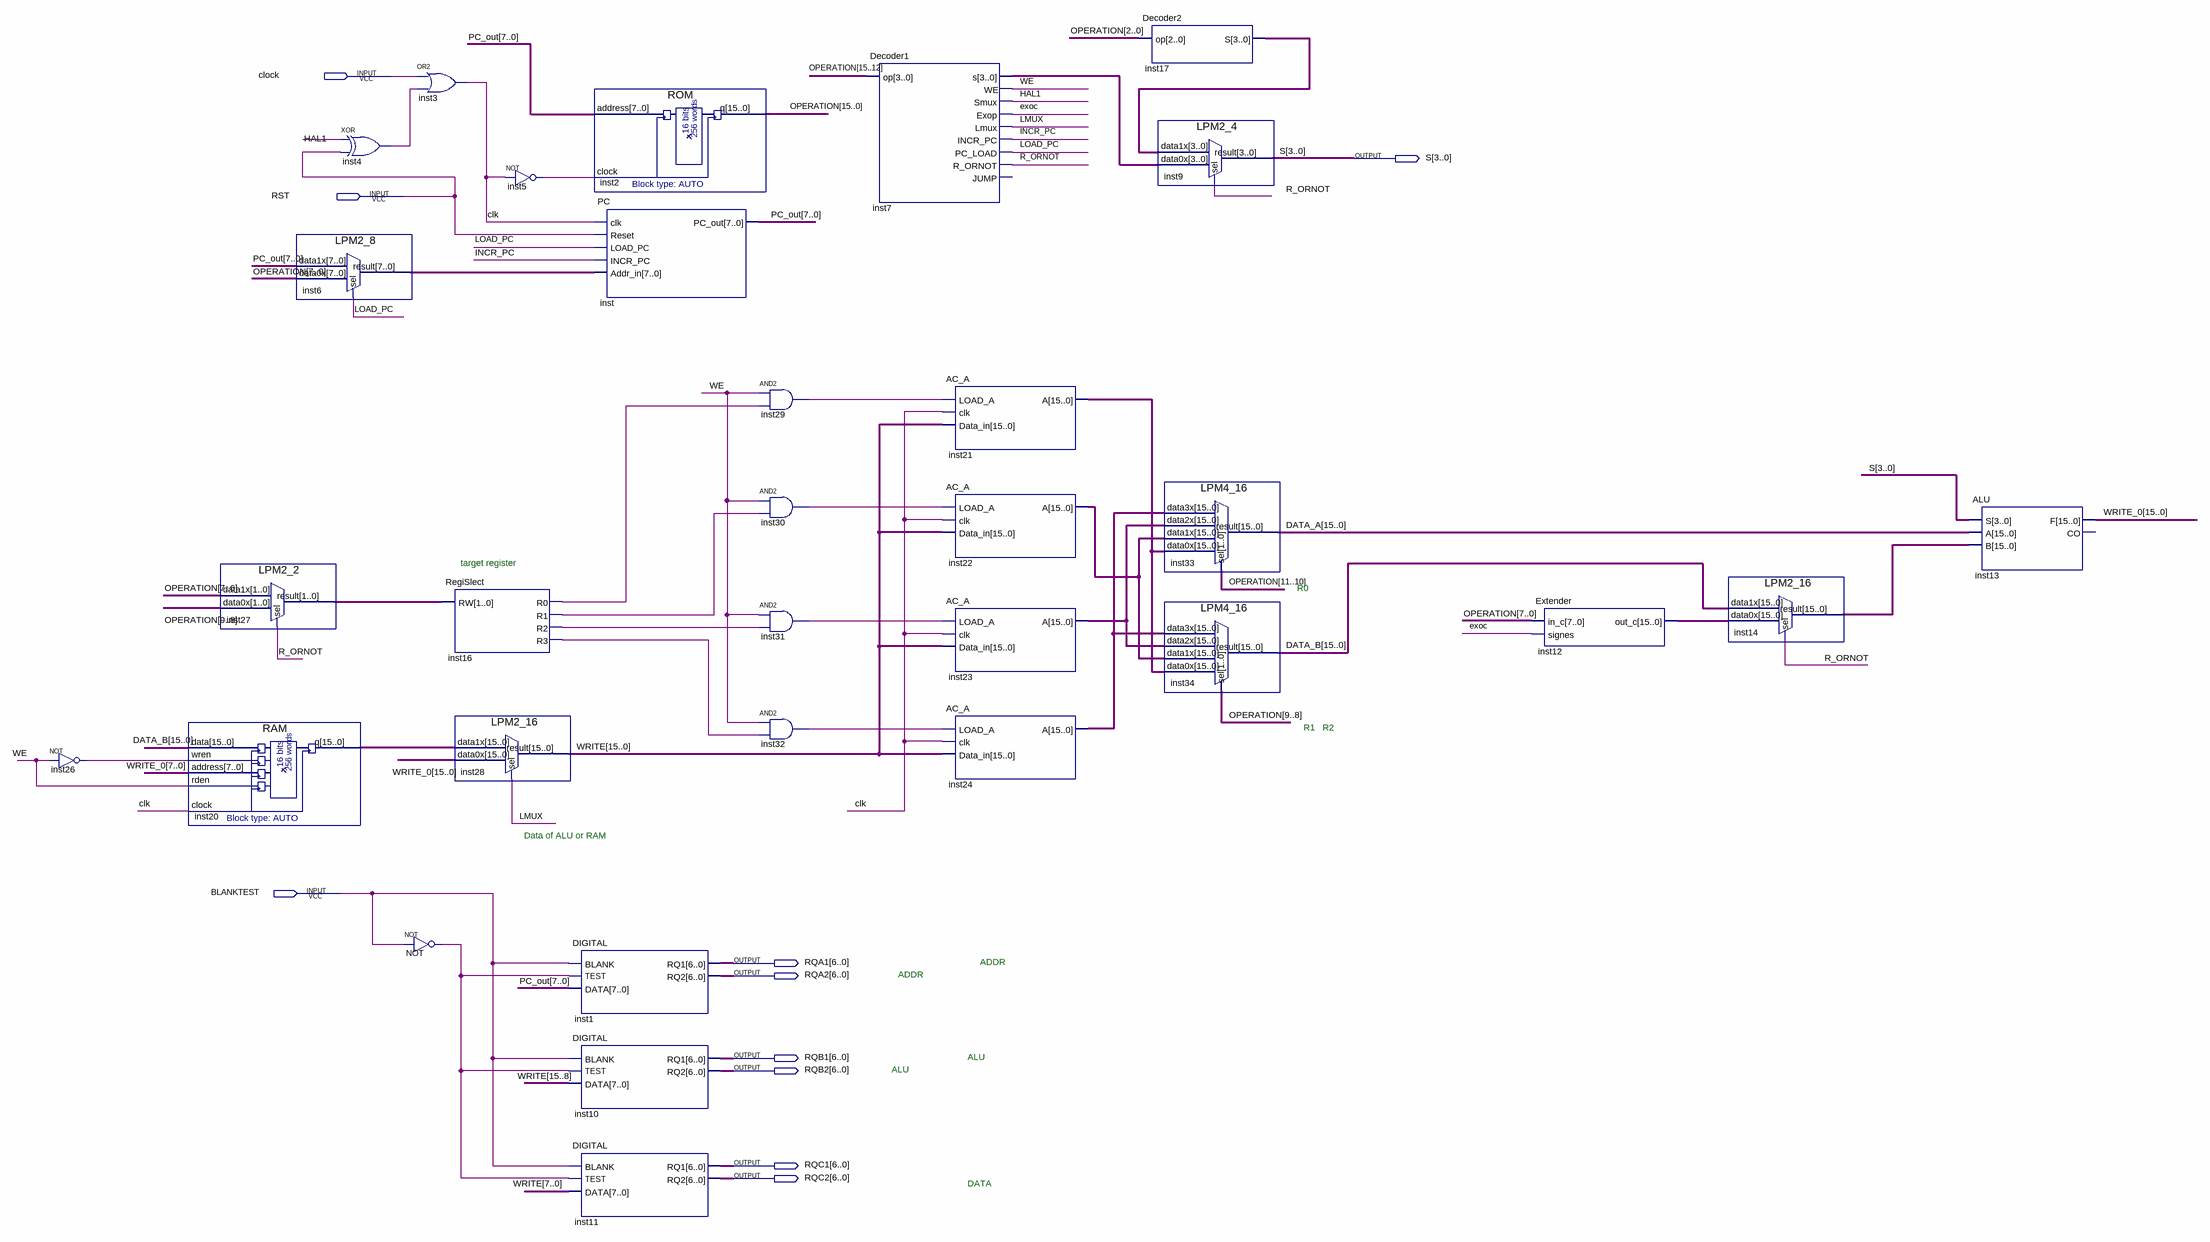
[diagram p0: schematic sheet]
// Quartus schematic CPU.bdf as structural Verilog: 31 symbols, 10 pins
module CPU (
  input  clock,
  input  RST,
  input  BLANKTEST,
  output [3:0] S,
  output [6:0] RQA1,
  output [6:0] RQA2,
  output [6:0] RQB1,
  output [6:0] RQB2,
  output [6:0] RQC1,
  output [6:0] RQC2
);

  wire clk, exoc, HAL1, INCR_PC, inst4_out, inst5_out, inst16_r0, inst16_r1, inst16_r2, inst16_r3,
       inst26_out, inst29_out, inst30_out, inst31_out, inst32_out, LMUX, LOAD_PC, NOT_out, R_ORNOT, WE;
  wire [1:0] inst27_result;
  wire [3:0] inst7_s, inst17_s;
  wire [7:0] inst6_result, PC_out;
  wire [15:0] DATA_A, DATA_B, inst12_out_c, inst14_result, inst20_q, inst21_a, inst22_a, inst23_a, inst24_a,
       OPERATION, WRITE, WRITE_0;

  not inst26 (inst26_out, WE);
  RAM inst20 (.data(DATA_B), .wren(inst26_out), .address(WRITE_0[7:0]), .rden(WE), .clock(clk), .q(inst20_q));
  LPM2_2 inst27 (.data1x(OPERATION[7:6]), .data0x(OPERATION[9:8]), .sel(R_ORNOT), .result(inst27_result));
  xor inst4 (inst4_out, HAL1, RST);
  LPM2_8 inst6 (.data1x(PC_out), .data0x(OPERATION[7:0]), .sel(LOAD_PC), .result(inst6_result));
  or inst3 (clk, clock, inst4_out);
  RegiSlect inst16 (.RW(inst27_result), .R0(inst16_r0), .R1(inst16_r1), .R2(inst16_r2), .R3(inst16_r3));
  not NOT (NOT_out, BLANKTEST);
  LPM2_16 inst28 (.data1x(inst20_q), .data0x(WRITE_0), .sel(LMUX), .result(WRITE));
  not inst5 (inst5_out, clk);
  ROM inst2 (.address(PC_out), .clock(inst5_out), .q(OPERATION));
  PC inst (.clk(clk), .Reset(RST), .LOAD_PC(LOAD_PC), .INCR_PC(INCR_PC), .Addr_in(inst6_result), .PC_out(PC_out));
  DIGITAL inst1 (.BLANK(BLANKTEST), .TEST(NOT_out), .DATA(PC_out), .RQ1(RQA1), .RQ2(RQA2));
  DIGITAL inst10 (.BLANK(BLANKTEST), .TEST(NOT_out), .DATA(WRITE[15:8]), .RQ1(RQB1), .RQ2(RQB2));
  DIGITAL inst11 (.BLANK(BLANKTEST), .TEST(NOT_out), .DATA(WRITE[7:0]), .RQ1(RQC1), .RQ2(RQC2));
  and inst29 (inst29_out, WE, inst16_r0);
  and inst30 (inst30_out, WE, inst16_r1);
  and inst31 (inst31_out, WE, inst16_r2);
  and inst32 (inst32_out, WE, inst16_r3);
  Decoder1 inst7 (
    .op(OPERATION[15:12]), .s(inst7_s), .WE(WE), .Smux(HAL1), .Exop(exoc), .Lmux(LMUX), .INCR_PC(INCR_PC),
    .PC_LOAD(LOAD_PC), .R_ORNOT(R_ORNOT));  // open: JUMP
  AC_A inst21 (.LOAD_A(inst29_out), .clk(clk), .Data_in(WRITE), .A(inst21_a));
  AC_A inst22 (.LOAD_A(inst30_out), .clk(clk), .Data_in(WRITE), .A(inst22_a));
  AC_A inst23 (.LOAD_A(inst31_out), .clk(clk), .Data_in(WRITE), .A(inst23_a));
  AC_A inst24 (.LOAD_A(inst32_out), .clk(clk), .Data_in(WRITE), .A(inst24_a));
  Decoder2 inst17 (.op(OPERATION[2:0]), .S(inst17_s));
  LPM2_4 inst9 (.data1x(inst17_s), .data0x(inst7_s), .sel(R_ORNOT), .result(S));
  LPM4_16 inst33 (
    .data3x(inst24_a), .data2x(inst23_a), .data1x(inst22_a), .data0x(inst21_a), .sel(OPERATION[11:10]),
    .result(DATA_A));
  LPM4_16 inst34 (
    .data3x(inst24_a), .data2x(inst23_a), .data1x(inst22_a), .data0x(inst21_a), .sel(OPERATION[9:8]),
    .result(DATA_B));
  Extender inst12 (.in_c(OPERATION[7:0]), .signes(exoc), .out_c(inst12_out_c));
  LPM2_16 inst14 (.data1x(DATA_B), .data0x(inst12_out_c), .sel(R_ORNOT), .result(inst14_result));
  ALU inst13 (.S(S), .A(DATA_A), .B(inst14_result), .F(WRITE_0));  // open: CO

  // Notes on the sheet:
  //   target register
  //   R0
  //   R1   R2
  //   Data of ALU or RAM
  //   ADDR
  //   ADDR
  //   ALU
  //   ALU
  //   DATA
endmodule
